# EAGLE design stromplatine3 (EAGLE 6.6.0)

## Sheet 1 of 9
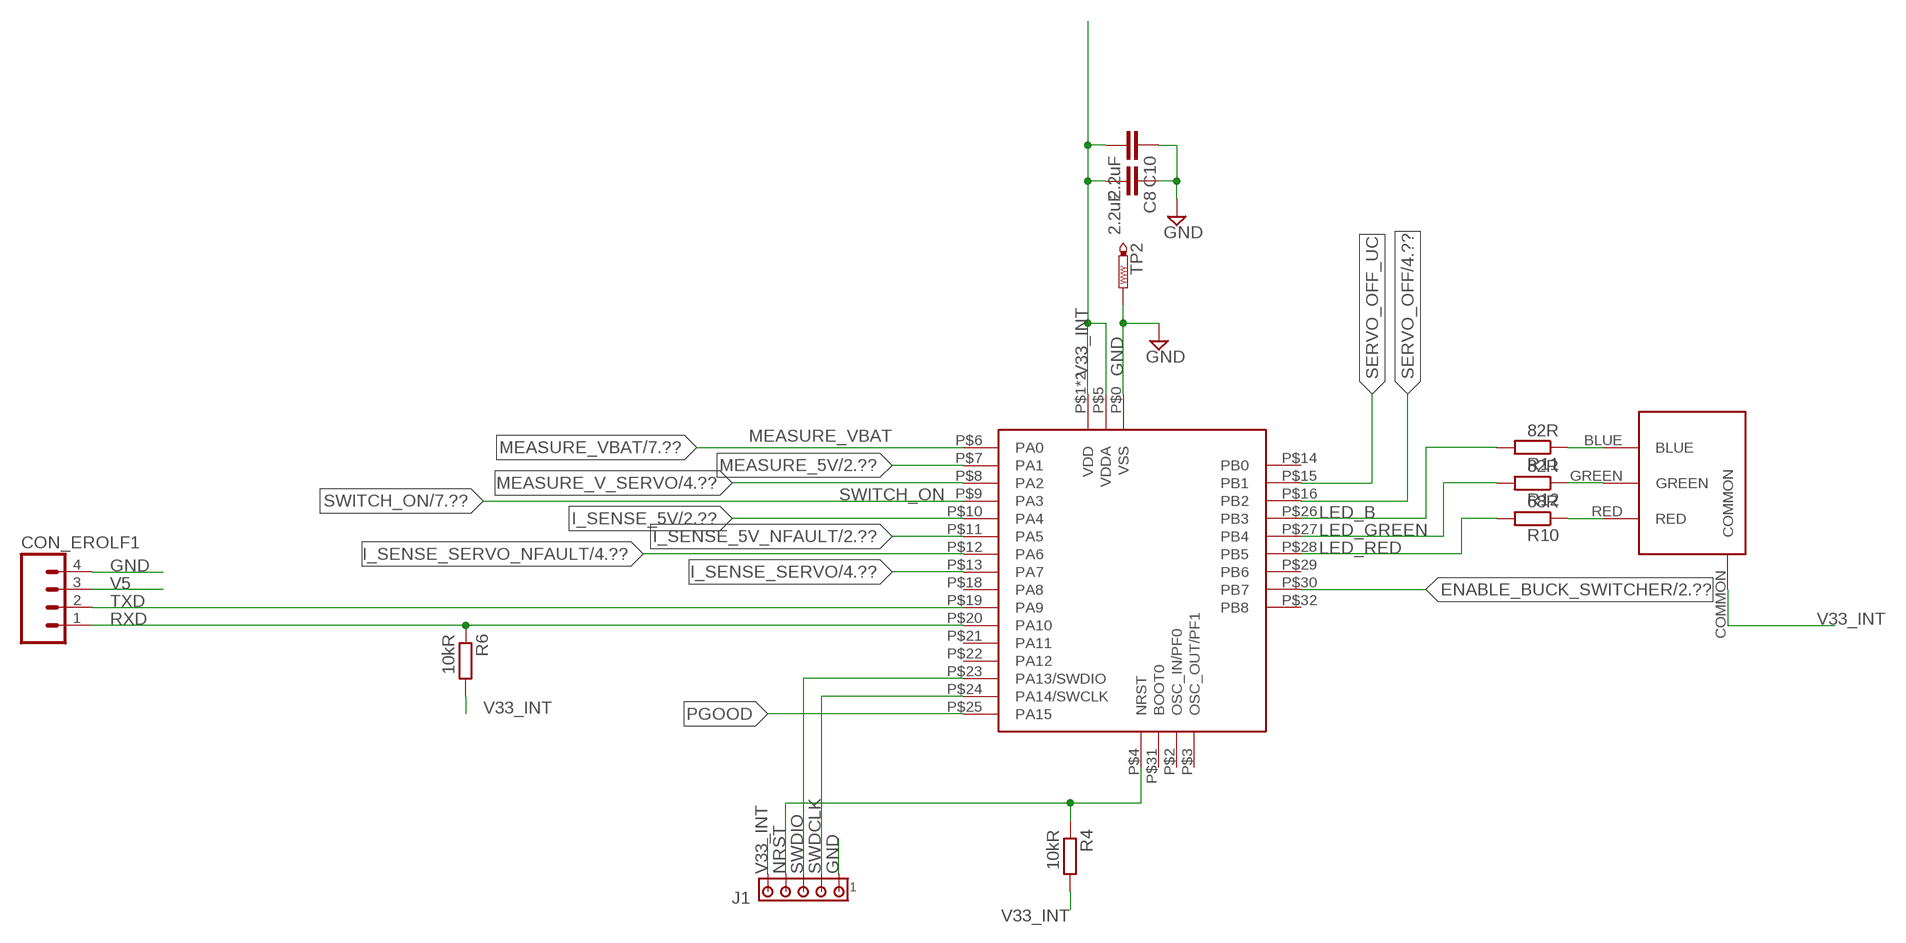
[diagram p0: schematic, sheet 1]

### Parts
C8  2.2uF  C-EUC0402  [C0402]
C10  2.2uF  C-EUC0402  [C0402]
CON_EROLF1  M04  [04P]
J1  MTA05-100  [10X05MTA]
R4  10kR  R-EU_R0603  [R0603]
R6  10kR  R-EU_R0603  [R0603]
R10  68R  R-EU_R0603  [R0603]
R11  82R  R-EU_R0603  [R0603]
R12  82R  R-EU_R0603  [R0603]
TP2  PTR1B1,27  [B1,27]
U$1  STM32F051K8  [UFQFPN32]
U$3  RGB-LED  [4-PLCC]

### Nets
ENABLE_BUCK_SWITCHER: U$1.P$30(PB7) ; also sheet 2
GND: C8.1 C10.1 CON_EROLF1.4 J1.1 TP2.TP U$1.P$0(VSS) ; also sheet 2,3,4,5,6,7,8
I_SENSE_5V: U$1.P$10(PA4) ; also sheet 2
I_SENSE_5V_NFAULT: U$1.P$11(PA5) ; also sheet 2
I_SENSE_SERVO: U$1.P$13(PA7) ; also sheet 4
I_SENSE_SERVO_NFAULT: U$1.P$12(PA6) ; also sheet 4
LED_B: R11.2 U$1.P$26(PB3)
LED_GREEN: R12.2 U$1.P$27(PB4)
LED_RED: R10.2 U$1.P$28(PB5)
MEASURE_5V: U$1.P$7(PA1) ; also sheet 2
MEASURE_V_SERVO: U$1.P$8(PA2) ; also sheet 4
MEASURE_VBAT: U$1.P$6(PA0) ; also sheet 7
N$11: R10.1 U$3.RED
N$12: R12.1 U$3.GREEN
N$13: R11.1 U$3.BLUE
NRST: J1.4 R4.1 U$1.P$4(NRST)
PGOOD: U$1.P$25(PA15)
RXD: CON_EROLF1.1 R6.1 U$1.P$20(PA10)
SERVO_OFF: U$1.P$16(PB2) ; also sheet 4,5
SERVO_OFF_UC: U$1.P$15(PB1)
SWDCLK: J1.2 U$1.P$24(PA14/SWCLK)
SWDIO: J1.3 U$1.P$23(PA13/SWDIO)
SWITCH_ON: U$1.P$9(PA3) ; also sheet 7
TXD: CON_EROLF1.2 U$1.P$19(PA9)
V5: CON_EROLF1.3 ; also sheet 2,3
V33_INT: C8.2 C10.2 J1.5 R4.2 R6.2 U$1.P$1(VDD) U$1.P$5(VDDA) U$1.P$17(VDD) U$3.COMMON ; also sheet 2,4,8
Unconnected: U$1.P$2(OSC_IN/PF0) U$1.P$3(OSC_OUT/PF1) U$1.P$14(PB0) U$1.P$18(PA8) U$1.P$21(PA11) U$1.P$22(PA12) U$1.P$29(PB6) U$1.P$31(BOOT0) U$1.P$32(PB8)

## Sheet 2 of 9
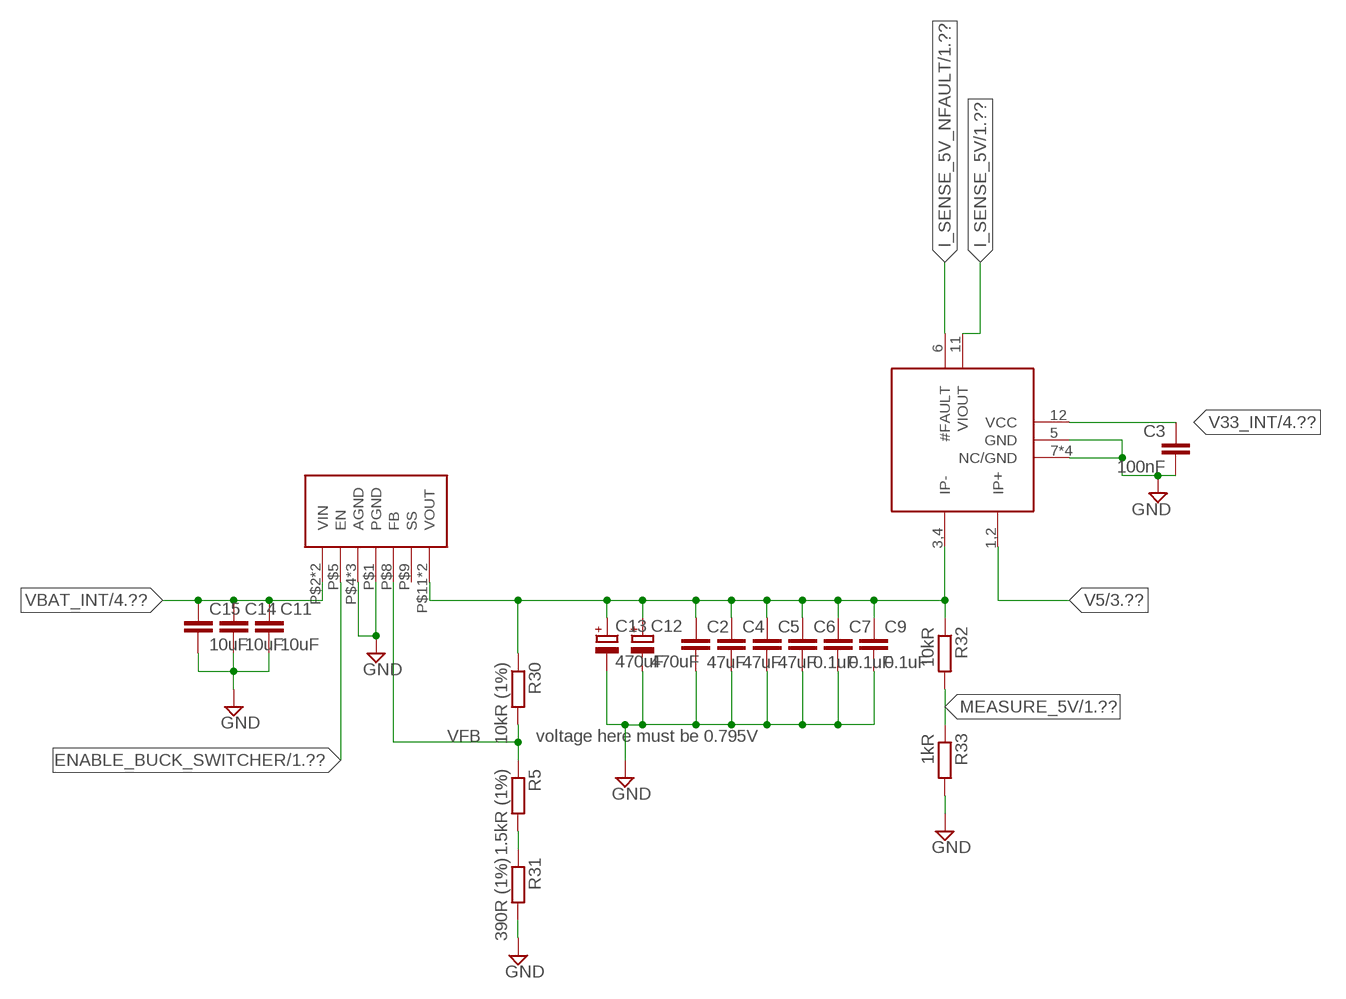
[diagram p1: schematic, sheet 2]

### Parts
C2  47uF  C-EUC1206  [C1206]
C3  100nF  C-EUC0402  [C0402]
C4  47uF  C-EUC1206  [C1206]
C5  47uF  C-EUC1206  [C1206]
C6  0.1uF  C-EUC0603  [C0603]
C7  0.1uF  C-EUC0603  [C0603]
C9  0.1uF  C-EUC0603  [C0603]
C11  10uF  C-EUC1206  [C1206]
C12  470uF  CPOL-EU175TMP-0810  [175TMP-0810]
C13  470uF  CPOL-EU175TMP-0810  [175TMP-0810]
C14  10uF  C-EUC1206  [C1206]
C15  10uF  C-EUC1206  [C1206]
R5  1.5kR (1%)  R-EU_R0603  [R0603]
R30  10kR (1%)  R-EU_R0603  [R0603]
R31  390R (1%)  R-EU_R0603  [R0603]
R32  10kR  R-EU_R0603  [R0603]
R33  1kR  R-EU_R0603  [R0603]
U$10  ACS711  [QFN-12-EX]
U$11  LMZ12010  [TZA11A]

### Nets
ENABLE_BUCK_SWITCHER: U$11.P$5(EN) ; also sheet 1
GND: C2.2 C3.2 C4.2 C5.2 C6.2 C7.2 C9.2 C11.2 C12.- C13.- C14.2 C15.2 R31.2 R33.2 U$10.5(GND) U$10.7(NC/GND) U$10.8(NC/GND) U$10.9(NC/GND) U$10.10(NC/GND) U$11.P$1(PGND) U$11.P$4(AGND) U$11.P$6(AGND) U$11.P$7(AGND) ; also sheet 1,3,4,5,6,7,8
I_SENSE_5V: U$10.11(VIOUT) ; also sheet 1
I_SENSE_5V_NFAULT: U$10.6(#FAULT) ; also sheet 1
MEASURE_5V: R32.2 R33.1 ; also sheet 1
N$4: R5.2 R31.1
N$27: C2.1 C4.1 C5.1 C6.1 C7.1 C9.1 C12.+ C13.+ R30.1 R32.1 U$10.3,4(IP-) U$11.P$11(VOUT) U$11.P$12(VOUT)
V5: U$10.1,2(IP+) ; also sheet 1,3
V33_INT: C3.1 U$10.12(VCC) ; also sheet 1,4,8
VBAT_INT: C11.1 C14.1 C15.1 U$11.P$2(VIN) U$11.P$3(VIN) ; also sheet 4,7,8
VFB: R5.1 R30.2 U$11.P$8(FB)
Unconnected: U$11.P$9(SS)

### Notes on the sheet
- voltage here must be 0.795V

## Sheet 3 of 9
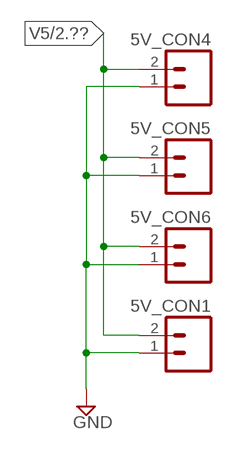
[diagram p2: schematic, sheet 3]

### Parts
5V_CON1  M02  [02P]
5V_CON4  M02  [02P]
5V_CON5  M02  [02P]
5V_CON6  M02  [02P]

### Nets
GND: 5V_CON1.1 5V_CON4.1 5V_CON5.1 5V_CON6.1 ; also sheet 1,2,4,5,6,7,8
V5: 5V_CON1.2 5V_CON4.2 5V_CON5.2 5V_CON6.2 ; also sheet 1,2

## Sheet 4 of 9
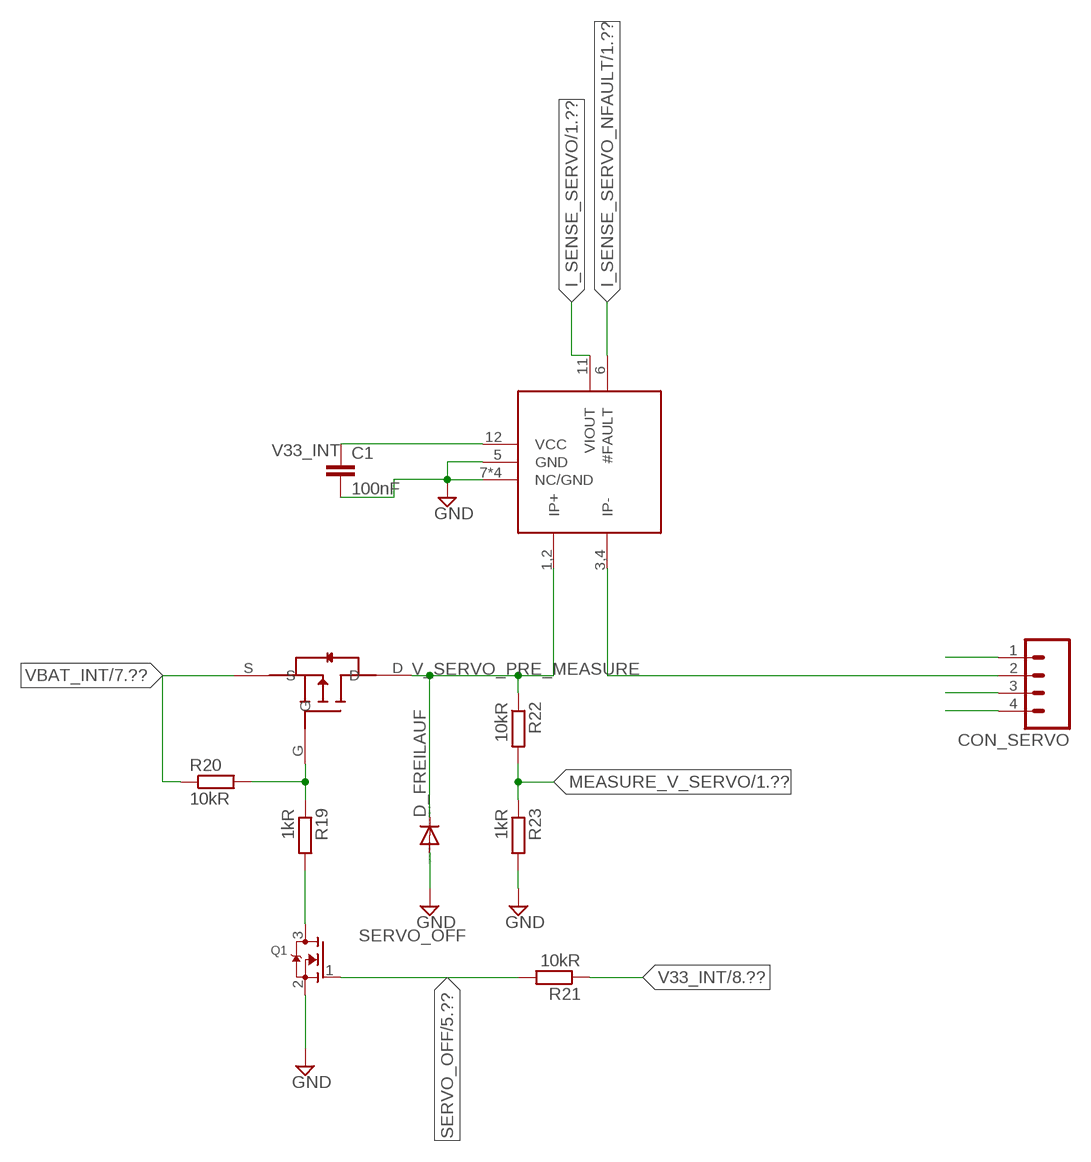
[diagram p3: schematic, sheet 4]

### Parts
C1  100nF  C-EUC0402  [C0402]
CON_SERVO  M04  [04P]
D_FREILAUF  DIODE-DO-214AC  [DO-214AC]
Q1  MOSFET-NREFLOW  [SOT23]
R19  1kR  R-EU_R0603  [R0603]
R20  10kR  R-EU_R0603  [R0603]
R21  10kR  R-EU_R0603  [R0603]
R22  10kR  R-EU_R0603  [R0603]
R23  1kR  R-EU_R0603  [R0603]
U$6  ACS711  [QFN-12-EX]
U$7  MOSFET/AOD417  [TO-252]

### Nets
GND: C1.2 CON_SERVO.1 D_FREILAUF.A Q1.2(S) R23.2 U$6.5(GND) U$6.7(NC/GND) U$6.8(NC/GND) U$6.9(NC/GND) U$6.10(NC/GND) ; also sheet 1,2,3,5,6,7,8
I_SENSE_SERVO: U$6.11(VIOUT) ; also sheet 1
I_SENSE_SERVO_NFAULT: U$6.6(#FAULT) ; also sheet 1
MEASURE_V_SERVO: R22.2 R23.1 ; also sheet 1
N$8: Q1.3(D) R19.2
N$14: R19.1 R20.2 U$7.G
RS485_SERVO_A: CON_SERVO.3
RS485_SERVO_B: CON_SERVO.4
SERVO_OFF: Q1.1(G) R21.2 ; also sheet 1,5
V33_INT: C1.1 R21.1 U$6.12(VCC) ; also sheet 1,2,8
V_SERVO: CON_SERVO.2 U$6.3,4(IP-)
V_SERVO_PRE_MEASURE: D_FREILAUF.C R22.1 U$6.1,2(IP+) U$7.D
VBAT_INT: R20.1 U$7.S ; also sheet 2,7,8

## Sheet 5 of 9
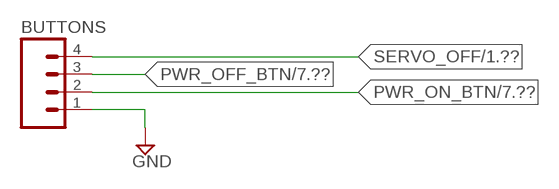
[diagram p4: schematic, sheet 5]

### Parts
BUTTONS  M04  [04P]

### Nets
GND: BUTTONS.1 ; also sheet 1,2,3,4,6,7,8
PWR_OFF_BTN: BUTTONS.3 ; also sheet 7
PWR_ON_BTN: BUTTONS.2 ; also sheet 7
SERVO_OFF: BUTTONS.4 ; also sheet 1,4

## Sheet 6 of 9
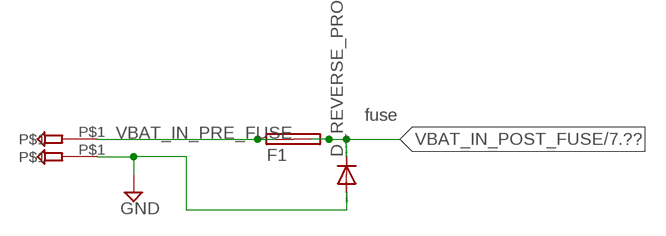
[diagram p5: schematic, sheet 6]

### Parts
D_REVERSE_PROT  DIODE-DO-214AC  [DO-214AC]
F1  SHK20Q  [SHK20Q]
U$8  TP  [TP]
U$9  TP  [TP]

### Nets
GND: D_REVERSE_PROT.A U$9.P$1 ; also sheet 1,2,3,4,5,7,8
VBAT_IN_POST_FUSE: D_REVERSE_PROT.C F1.2A F1.2B ; also sheet 7
VBAT_IN_PRE_FUSE: F1.1A F1.1B U$8.P$1

### Notes on the sheet
- fuse

## Sheet 7 of 9
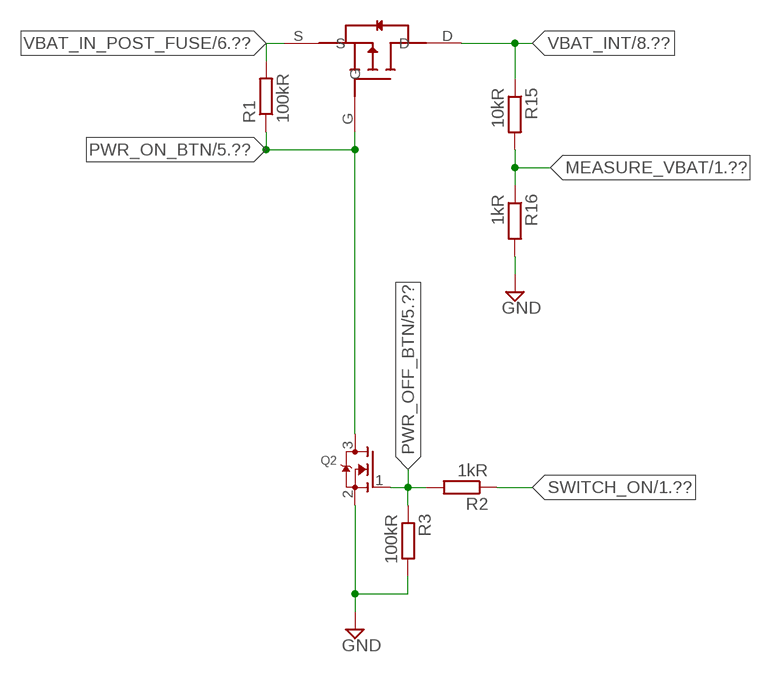
[diagram p6: schematic, sheet 7]

### Parts
Q2  MOSFET-NREFLOW  [SOT23]
R1  100kR  R-EU_R0603  [R0603]
R2  1kR  R-EU_R0603  [R0603]
R3  100kR  R-EU_R0603  [R0603]
R15  10kR  R-EU_R0603  [R0603]
R16  1kR  R-EU_R0603  [R0603]
U$4  MOSFET/AOD417  [TO-252]

### Nets
GND: Q2.2(S) R3.2 R16.2 ; also sheet 1,2,3,4,5,6,8
MEASURE_VBAT: R15.2 R16.1 ; also sheet 1
PWR_OFF_BTN: Q2.1(G) R2.2 R3.1 ; also sheet 5
PWR_ON_BTN: Q2.3(D) R1.1 U$4.G ; also sheet 5
SWITCH_ON: R2.1 ; also sheet 1
VBAT_IN_POST_FUSE: R1.2 U$4.S ; also sheet 6
VBAT_INT: R15.1 U$4.D ; also sheet 2,4,8

## Sheet 8 of 9
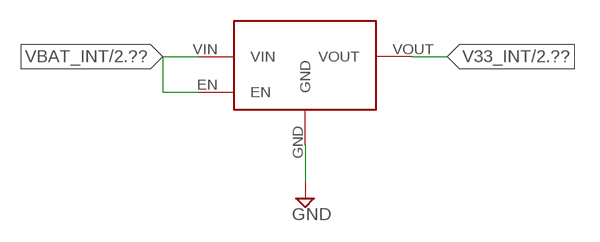
[diagram p7: schematic, sheet 8]

### Parts
U$2  LDO/AP2204  [SOT-23-5]

### Nets
GND: U$2.GND ; also sheet 1,2,3,4,5,6,7
V33_INT: U$2.VOUT ; also sheet 1,2,4
VBAT_INT: U$2.EN U$2.VIN ; also sheet 2,4,7

## Sheet 9 of 9
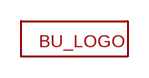
[diagram p8: schematic, sheet 9]

### Parts
U$5  LOGO  [LOGO]

## Library data of the parts
5V_CON1 5V_CON4-5V_CON6 = con-amp-quick:M02: AMP QUICK CONNECTOR; OC_FARNELL: unknown; OC_NEWARK: unknown
BUTTONS CON_EROLF1 CON_SERVO = con-amp-quick:M04: AMP QUICK CONNECTOR; OC_FARNELL: unknown; OC_NEWARK: unknown
C1-C10 = resistor:C-EU: CAPACITOR, European symbol
C11 C14 C15 = resistor:C-EU: CAPACITOR, European symbol; DIGIKEY: 587-1353-1-ND
C12 C13 = resistor:CPOL-EU: POLARIZED CAPACITOR, European symbol; DIGIKEY: 493-3771-1-ND
D_FREILAUF D_REVERSE_PROT = diode:DIODE-: DIODE
F1 = fuse:SHK20Q: FUSE HOLDER 5 x 20 mm, SH contact, E1207 Buerklin 64G6061; OC_FARNELL: unknown; OC_NEWARK: unknown
J1 = con-amp:MTA05-100: AMP connector
Q1 Q2 = adafruit:MOSFET-N: N-Channel Mosfet 2N7002E - 60V 260mA SOT23 [Digikey: 2N7002ET1GOSTR-ND] - REEL BSH103 - 30V 850mA SOT23 [Digikey: 568-5013-1-ND]
R1-R6 R10-R12 R15 R16 R19-R23 R30-R33 = resistor:R-EU_: RESISTOR, European symbol
TP2 = testpad:PTR1: TEST PIN
U$1 = stm32f051:STM32F051K8
U$2 = stromplatine:LDO/AP2204
U$3 = smd-rgbled:RGB-LED: rgb led http://www.digikey.com/product-detail/en/CLVBA-FKA-CAEDH8BBB7A363/CLVBA-FKA-CAEDH8BBB7A363CT-ND/2650500
U$4 U$7 = stromplatine:MOSFET/AOD417
U$5 = berlinunited:LOGO
U$6 U$10 = stromplatine:ACS711
U$8 U$9 = stromplatine:TP
U$11 = stromplatine:LMZ12010

## Board
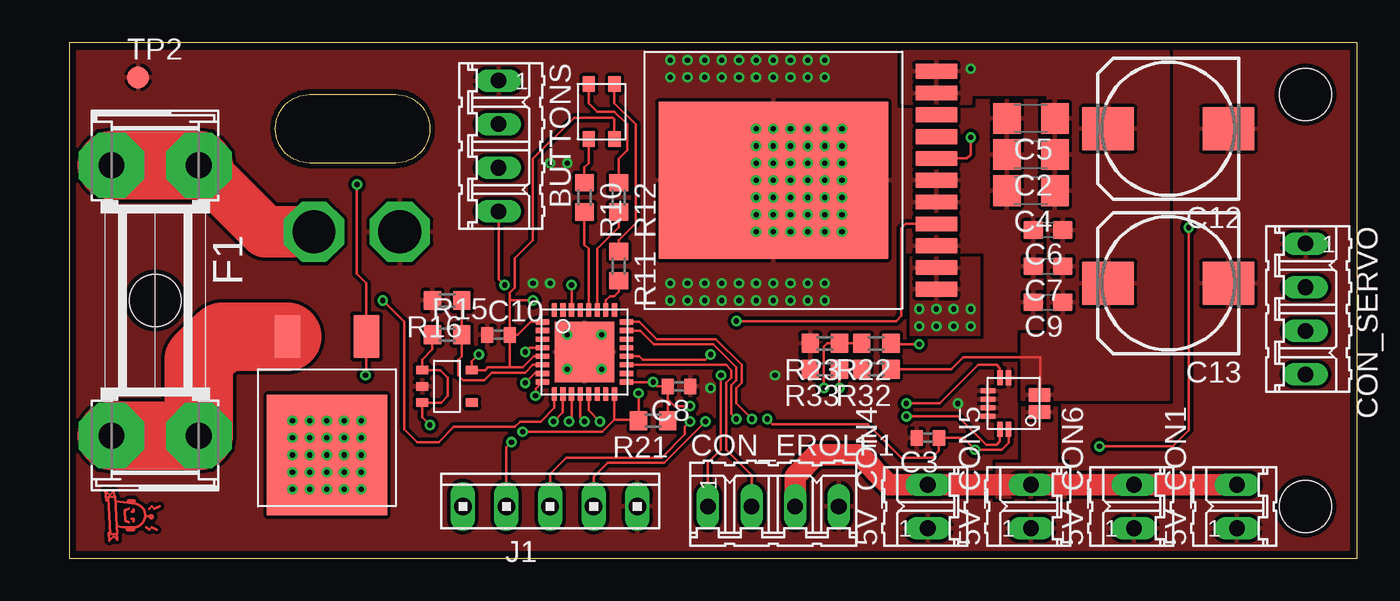
[diagram p9: board, top side]
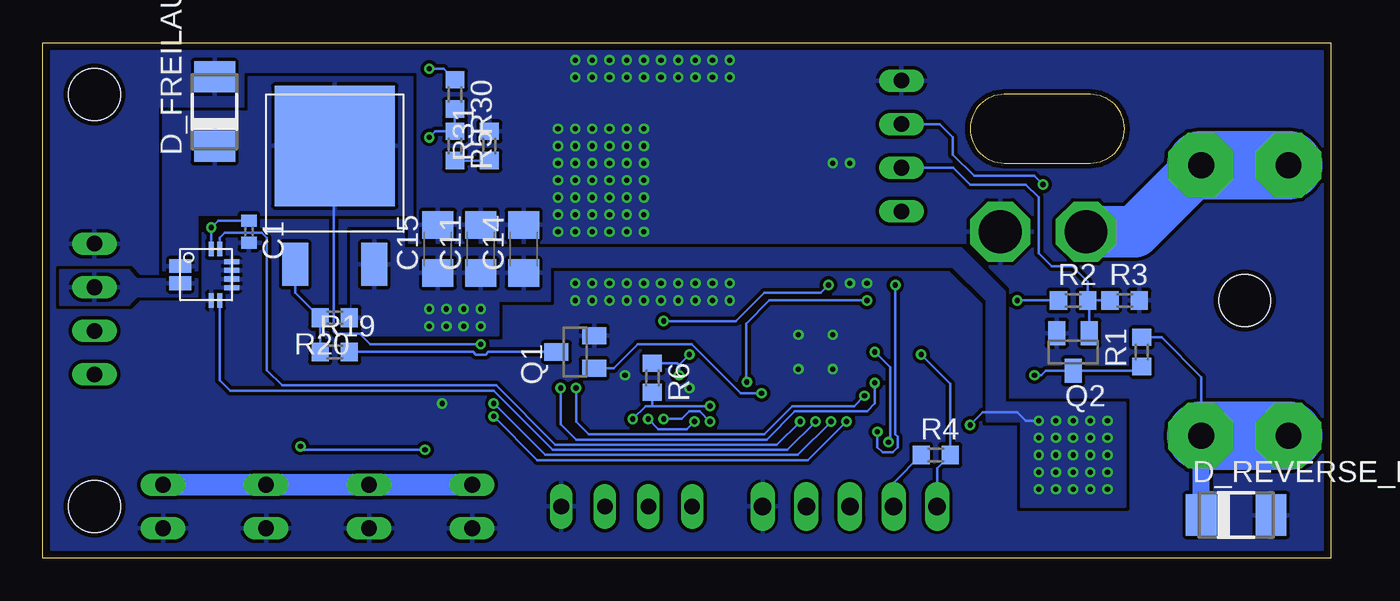
[diagram p10: board, bottom side, seen from below]

Size 75 x 30 mm. Coordinates in mm from the lower left corner, seen from the top.
Outline: 0,0 75,0 75,30 0,30 0,0
Copper layers (1*16): Top 0.035mm / dielectric 1.5mm / Bottom 0.035mm
Design rules "PCB-POOL Standard": minimum track width 0.15mm, minimum drill 0.3mm, track to track 0.15mm, track to pad 0.15mm, pad to pad 0.15mm, via to via 0.15mm, smd to smd 0.15mm, copper to edge 0.3mm, drill to drill 0.2mm, minimum pad ring 0.2mm, minimum via ring 0.15mm, stop-mask expansion 0.075mm, vias tented up to drill 0mil, thermal gap 0.2mm
Holes 3 mm at 5,15 72,3 72,27

### Footprints (pad centres in the part's own frame; a part is rotated, then mirrored left to right if it is on the bottom)
02P = drill 0.914 long: 1 -1.27,0; 2 1.27,0
04P = drill 0.914 long: 1 -3.81,0; 2 -1.27,0; 3 1.27,0; 4 3.81,0
C0402 = smd 0.7 x 0.9: 1 -0.65,0; 2 0.65,0
C1206 = smd 1.6 x 1.8: 1 -1.4,0; 2 1.4,0
C0603 = smd 1.1 x 1: 1 -0.85,0; 2 0.85,0
175TMP-0810 = smd 3 x 2.5: + 3.5,0; - -3.5,0
DO-214AC = smd 1.8 x 2.4: A 2.025,0; C -2.025,0
SHK20Q = drill 1.5 pad 3.81 octagon: 1A -7.874,2.54; 1B -7.874,-2.54; 2A 7.874,2.54; 2B 7.874,-2.54
10X05MTA = drill 1.016 long: 1 5.08,0; 2 2.54,0; 3 0,0; 4 -2.54,0; 5 -5.08,0
SOT23 = smd 1 x 1.4: 1 -0.95,-1.1; 2 0.95,-1.1; 3 0,1.1
R0603 = smd 1 x 1.1: 1 -0.85,0; 2 0.85,0
B1,27 = smd 1.27 x 1.27: TP 0,0
UFQFPN32 = smd 3.45 x 3.54: P$0 0,0 | smd 0.8 x 0.3: P$1 -2.45,1.75; P$2 -2.45,1.25; P$3 -2.45,0.75; P$4 -2.45,0.25; P$5 -2.45,-0.25; P$6 -2.45,-0.75; P$7 -2.45,-1.25; P$8 -2.45,-1.75; P$17 2.45,-1.75; P$18 2.45,-1.25; P$19 2.45,-0.75; P$20 2.45,-0.25; P$21 2.45,0.25; P$22 2.45,0.75; P$23 2.45,1.25; P$24 2.45,1.75 | smd 0.3 x 0.8: P$9 -1.75,-2.45; P$10 -1.25,-2.45; P$11 -0.75,-2.45; P$12 -0.25,-2.45; P$13 0.25,-2.45; P$14 0.75,-2.45; P$15 1.25,-2.45; P$16 1.75,-2.45; P$25 1.75,2.45; P$26 1.25,2.45; P$27 0.75,2.45; P$28 0.25,2.45; P$29 -0.25,2.45; P$30 -0.75,2.45; P$31 -1.25,2.45; P$32 -1.75,2.45
SOT-23-5 = smd 0.5 x 0.7: ADJ/NC 0.95,1.45; EN 0.95,-1.45; GND 0,-1.45; VIN -0.95,-1.45; VOUT -0.95,1.45
4-PLCC = smd 0.9 x 0.7: BLUE 1.6,-0.75; COMMON -1.6,-0.75; GREEN 1.6,0.75; RED -1.6,0.75
TO-252 = smd 7 x 7: D 0,0 | smd 1.5 x 2.5: G -2.3,-6.9; S 2.3,-6.9
QFN-12-EX = smd 1.27 x 0.8: 1,2 -1.5,0.5; 3,4 -1.5,-0.5 | smd 0.3 x 0.85: 5 0.3,-1.5; 6 0.8,-1.5; 11 0.8,1.5; 12 0.3,1.5 | smd 0.85 x 0.3: 7 1.5,-0.75; 8 1.5,-0.25; 9 1.5,0.25; 10 1.5,0.75
TP = drill 2.5 pad 3.5 octagon: P$1 0,0
TZA11A = smd 9.125 x 13.37: P$1 0,0 | smd 0.86 x 2.41: P$2 -6.35,-9.5; P$3 -5.08,-9.5; P$4 -3.81,-9.5; P$5 -2.54,-9.5; P$6 -1.27,-9.5; P$7 0,-9.5; P$8 1.27,-9.5; P$9 2.54,-9.5; P$10 3.81,-9.5; P$11 5.08,-9.5; P$12 6.35,-9.5

### Placement (x,y rotation side)
5V_CON1  68,3 90 top
5V_CON4  50,3 90 top
5V_CON5  56,3 90 top
5V_CON6  62,3 90 top
BUTTONS  25,24 270 top
C1  63,19 270 bottom
C2  56,23.5 180 top
C3  50,7 180 top
C4  56,21.4 180 top
C5  56,25.6 180 top
C6  57,19.1 180 top
C7  57,17 180 top
C8  35.5,10 180 top
C9  57,14.9 180 top
C10  25,13 0 top
C11  49.5,18 90 bottom
C12  64,25 180 top
C13  64,16 180 top
C14  47,18 90 bottom
C15  52,18 90 bottom
CON_EROLF1  41,3 0 top
CON_SERVO  72,14.5 270 top
D_FREILAUF  65,26 90 bottom
D_REVERSE_PROT  5.5,2.5 0 bottom
F1  5,15 270 top
J1  28,3 0 top
Q1  44,12 90 bottom
Q2  15,12 180 bottom
R1  11,12 90 bottom
R2  15,15 0 bottom
R3  12,15 0 bottom
R4  23,6 0 bottom
R5  51,24 270 bottom
R6  39.5,10.5 270 bottom
R10  30,21 270 top
R11  32,17 270 top
R12  32,21 270 top
R15  22,13 0 top
R16  22,15 180 top
R19  58,12 0 bottom
R20  58,14 180 bottom
R21  34,8 180 top
R22  47,12.5 180 top
R23  44,12.5 180 top
R30  51,27 270 bottom
R31  49,24 90 bottom
R32  47,11 180 top
R33  44,11 180 top
TP2  4,28 0 top
U$1  30,12 0 top
U$2  22,10 270 top
U$3  31,26 90 top
U$4  15,6 180 top
U$5  3.5,2.5 270 top
U$6  65.5,16.5 0 bottom
U$7  58,24 0 bottom
U$8  14.25,19 0 top
U$9  19.25,19 0 top
U$10  55,9 180 top
U$11  41,22 90 top

### Tracks (layer width: path | path; a pad name or v marks a point on that pad's centre or on a via)
ENABLE_BUCK_SWITCHER  (via drill 0.3)
  Top 0.15: U$11.P$5 48.71,19.46 48.45,19.2 48.45,14.1 48.15,13.8 v38.85,13.8 | U$1.P$30 v29.25,15.9
  Bottom 0.15: v29.25,15.9 29.7,15.45 33,15.45 34.65,13.8 v38.85,13.8
GND  (via drill 0.3)
  Top 0.15: v29,11 U$1.P$0
  other vias: 45,19 45,20 45,21 45,22 45,23 45,24 45,25 44,19 43,19 42,19 41,19 40,19 44,20 43,20 42,20 41,20 40,20 44,21 43,21 42,21 41,21 40,21 44,22 43,22 42,22 41,22 40,22 44,23 43,23 42,23 41,23 40,23 44,24 43,24 42,24 41,24 40,24 44,25 43,25 42,25 41,25 40,25 28,23 29,13 31,13 31,11 37,16 38,16 39,16 40,16 41,16 42,16 43,16 44,16 44,15 43,15 42,15 41,15 40,15 39,15 38,15 37,15 36,15 36,16 35,16 35,15 44,28 43,28 42,28 41,28 40,28 39,28 38,28 37,28 36,28 35,28 35,29 36,29 37,29 38,29 39,29 40,29 41,29 42,29 43,29 44,29 51.75,9 27,16 28,16 29,23 41.1,10.65 37.35,9.9
  pour Bottom (isolate 0.2, rank 2): 0.5,29.5 74.5,29.5 74.5,0.5 0.5,0.5
  pour Top (isolate 0.203, rank 2): 0.5,29.5 74.5,29.5 74.5,0.5 0.5,0.5
I_SENSE_5V  (via drill 0.3)
  Top 0.15: U$1.P$10 28.75,8.5 v28.2,7.95 | U$10.11 54.2,6.8 54,6.6 53.4,6.6 51.75,8.25 v48.75,8.25
  Bottom 0.15: v28.2,7.95 30.45,5.7 46.2,5.7 v48.75,8.25
I_SENSE_5V_NFAULT  (via drill 0.3)
  Top 0.15: U$1.P$11 29.25,8.1 v29.1,7.95 | v48.75,9 50.7,9 52.95,11.25 54,11.25 54.2,11.05 U$10.6
  Bottom 0.15: v29.1,7.95 31.05,6 45.75,6 v48.75,9
I_SENSE_SERVO  (via drill 0.3)
  Top 0.15: U$1.P$13 30.25,8.6 v30.9,7.95
  Bottom 0.15: v30.9,7.95 32.25,6.6 45.15,6.6 48.6,10.05 61.05,10.05 61.95,10.95 61.95,18.65 62.25,18.95 64.4,18.95 64.7,18.65 U$6.11
I_SENSE_SERVO_NFAULT  (via drill 0.3)
  Top 0.15: U$1.P$12 29.75,8.2 v30,7.95
  Bottom 0.15: v30,7.95 31.65,6.3 45.3,6.3 48.75,9.75 64.1,9.75 64.7,10.35 U$6.6
LED_B
  Top 0.15: U$1.P$26 31.25,15 31.5,15.25 31.75,15.25 32,15.5 R11.2
LED_GREEN
  Top 0.15: U$1.P$27 30.75,18 32,19.25 R12.2
LED_RED
  Top 0.15: U$1.P$28 30.25,18 30,18.25 R10.2
MEASURE_5V  (via drill 0.3)
  Top 0.15: R32.2 R33.1 v44.85,9.9 | U$1.P$7 27.1,10.75 v26.55,10.2
  Bottom 0.15: v26.55,10.2 26.55,9 27,8.55 31.2,8.55 32.85,6.9 43.95,6.9 44.85,7.8 v44.85,9.9
MEASURE_V_SERVO  (via drill 0.3)
  Top 0.15: U$1.P$8 27.15,9.85 v27.15,9.45 | R22.2 R23.1 44.15,12.5 43.95,12.3 v43.95,9.9
  Bottom 0.15: v27.15,9.45 27.75,8.85 31.35,8.85 33,7.2 43.2,7.2 43.95,7.95 v43.95,9.9
MEASURE_VBAT
  Top 0.15: U$1.P$6 26.99,11.25 26.54,10.8 24.61,10.8 24.16,10.35 22.95,10.35 22.65,10.65 22.65,11.55 22.85,11.75 R15.2 R16.1
N$4
  Bottom 0.15: R31.1 R5.2
N$8
  Bottom 0.15: Q1.3 49.05,12 49.2,11.85 49.8,11.85 49.95,12 R19.2
N$11
  Top 0.15: R10.1 30,22.75 30.25,23 U$3.RED
N$12
  Top 0.15: R12.1 32,23.25 32.5,23.75 32.5,25.25 31.75,26 30.75,26 30.25,26.5 U$3.GREEN
N$13
  Top 0.15: R11.1 32,18.5 33,19.5 33,25.25 31.75,26.5 U$3.BLUE
N$14
  Bottom 0.15: U$7.G 60.3,15.45 R20.2 R19.1
N$27  (via drill 0.3)
  Top 0.15: R32.1 51.35,11 52.05,11.7 56.55,11.7 56.55,9.55 U$10.3,4
  Bottom 0.15: R30.1 51.65,28.5 v52.5,28.5
  pour Top: 48.5,29.5 48.5,26.5 52.5,26.5 52.5,27 57,27 57,13 55.5,13 55.5,9.25 64,9.25 64,29.5
NRST  (via drill 0.3)
  Top 0.15: U$1.P$4 26.8,12.25 v26.55,12 | v25.75,6.75 25.46,6.46 J1.4
  Bottom 0.15: v26.55,12 25.65,11.1 25.65,6.85 v25.75,6.75 | R4.1 25.46,4.39 J1.4
PWR_OFF_BTN
  Bottom 0.15: R2.2 R3.1 | R2.2 14.05,14.9 Q2.1 | R2.2 14.15,16.1 15.05,17 16.25,17 17,17.75 17,21 17.75,21.75 21,21.75 21.98,22.73 BUTTONS.3
PWR_ON_BTN  (via drill 0.3)
  Top 0.15: 17.25,12.95 U$4.G | U$4.G 17.3,16 16.75,16.55 v16.75,21.75 | v17.25,10.65 17.3,10.7 U$4.G
  Bottom 0.15: R1.1 11.25,10.9 Q2.3 16.6,10.9 16.85,10.65 v17.25,10.65 | v16.75,21.75 17.25,22.25 20.75,22.25 22,23.5 22,24.5 22.77,25.27 BUTTONS.2
RXD  (via drill 0.3)
  Top 0.15: U$1.P$20 33.2,11.75 33.4,11.55 37.05,11.55 v37.35,11.85 | v37.95,10.65 37.95,6.3 37.19,5.54 CON_EROLF1.1
  Bottom 0.15: v37.35,11.85 37.95,11.25 | 37.95,11.25 v37.95,10.65 | R6.1 38.05,11.35 37.95,11.25
SERVO_OFF  (via drill 0.3)
  Top 0.15: 25.05,20.14 BUTTONS.4 25,16.25 v25.35,15.9 | v26.4,7.35 31.05,7.35 31.75,8.05 | 31.75,8.05 U$1.P$16 | 31.75,8.05 33.1,8.05 R21.2 v33.15,9.6
  Bottom 0.15: v25.35,15.9 25.35,7.2 25.2,7.05 25.2,6.45 25.5,6.15 26.1,6.15 26.4,6.45 v26.4,7.35 | Q1.1 41.75,11.05 40.35,12.45 37.2,12.45 34.35,9.6 v33.15,9.6
SWDCLK  (via drill 0.3)
  Top 0.15: U$1.P$24 33.2,13.75 34.2,12.75 37.65,12.75 39.15,11.25 39.15,10.2 38.85,9.9 38.85,9 v39.75,8.1 | v37.05,7.95 34.65,5.55 31.35,5.55 30.54,4.74 J1.2
  Bottom 0.15: v37.05,7.95 37.5,7.5 39.15,7.5 v39.75,8.1
SWDIO  (via drill 0.3)
  Top 0.15: U$1.P$23 33.25,13.25 34.05,12.45 37.5,12.45 38.85,11.1 38.85,10.35 38.55,10.05 38.55,8.4 v38.85,8.1 | v36.15,7.95 35.85,7.65 35.85,7.2 34.5,5.85 28.95,5.85 28,4.9 J1.3
  Bottom 0.15: v36.15,7.95 36.75,8.55 37.35,8.55 37.8,8.1 v38.85,8.1
SWITCH_ON  (via drill 0.3)
  Top 0.15: v18.25,15 19.5,13.75 19.5,7.5 20.25,6.75 21.5,6.75 22.4,7.65 25.95,7.65 26.25,7.95 27.45,7.95 28.25,8.75 U$1.P$9
  Bottom 0.15: R2.1 v18.25,15
TXD
  Top 0.15: U$1.P$19 38.25,11.25 38.55,10.95 38.55,10.5 38.25,10.2 38.25,6.3 39.73,4.82 CON_EROLF1.2
V5
  Top 1.25: 5V_CON1.2 5V_CON6.2 5V_CON5.2 5V_CON4.2 47.73,4.27 46,6 43.5,6 42.27,4.77 CON_EROLF1.3
  Bottom 1.25: 5V_CON4.2 5V_CON5.2 5V_CON6.2 5V_CON1.2
  pour Top (isolate 0.2): 55.5,8.75 57.5,8.75 57.5,5.5 58,5.5 58,3.5 54,3.5 54,5.5 55.5,5.5
V33_INT  (via drill 0.3)
  Top 0.15: U$1.P$5 27.05,11.75 26.4,11.1 25.65,11.1 | U$1.P$17 v34,10.25 34.25,10 C8.2 34.85,9.25 | U$3.COMMON 31.75,25.55 31.65,25.65 29.4,25.65 27,23.25 27,18.5 25.95,17.45 25.95,15.75 25.65,15.45 25.65,15 | 25.65,15 C10.2 | U$1.P$1 26.87,13.75 26.12,13 C10.2 | 25.6,12.95 C10.2 | 25.65,11.1 24.38,11.1 24.23,10.95 U$2.VOUT 23.45,11.45 v23.85,11.85 | 25.65,11.1 C10.2 | 34.85,9.25 R21.1 | v27,15 25.65,15 | U$10.12 54.7,6.7 54.3,6.3 v52.75,6.3 52.05,7 C3.1 50.65,6.25 50.25,5.85 48.45,5.85 46.5,7.8 40.95,7.8 v40.65,8.1 | v60,6.5 64.25,6.5 65.2,7.45 v65.2,19.25 | 34.85,9.25 35.25,8.85 v36.15,8.85
  Bottom 0.15: v23.85,11.85 22.15,10.15 R4.2 22.92,5.23 J1.5 | v27,15 32.7,15 34.05,13.65 34.05,10.3 v34,10.25 | U$6.12 v65.2,19.25 64.8,19.65 C1.1 | v52.75,6.3 59.8,6.3 v60,6.5 | v36.15,8.85 39.5,8.85 | 39.5,8.85 39.9,8.85 v40.65,8.1 | R6.2 39.5,8.85
V_SERVO
  pour Bottom (isolate 0.2): 66,16.25 69.5,16.25 70,16.75 74,16.75 74,14.75 70,14.75 69.5,15.25 66,15.25
V_SERVO_PRE_MEASURE  (via drill 0.3)
  Top 0.15: R22.1 47.9,12.45 v49.5,12.45
  Bottom 0.15: v49.5,12.45 55.95,12.45 56.55,13.05 57.9,13.05 58.05,13.2 58.05,23.95 U$7.D
  pour Bottom (isolate 0.2): 53.5,28 63,28 63,26 68,26 68,16.75 66,16.75 66,20 53.5,20
VBAT_IN_POST_FUSE
  Top 4: F1.2B F1.2A 7.54,11.54 8.9,12.9 U$4.S
  Bottom 0.15: R1.2 9.85,12.85 7.54,10.54 F1.2A
  Bottom 1: D_REVERSE_PROT.C F1.2A
  Bottom 4: F1.2B F1.2A
VBAT_IN_PRE_FUSE
  Top 3: F1.1A 11.41,19 U$8.P$1
  Top 4: F1.1B F1.1A
  Bottom 3: 11.41,19 F1.1A | U$8.P$1 11.5,19
  Bottom 4: F1.1B F1.1A
VBAT_INT  (via drill 0.3)
  Top 0.15: R15.1 21.15,12.15 20.55,11.55 U$2.VIN 21.6,10.95 22.05,10.5 22.05,9.45 21.65,9.05 U$2.EN 20.55,8.2 v21,7.75
  Bottom 0.15: v21,7.75 20.25,8.5 18.25,8.5 17.75,8 v17,8
  other vias: 13,8 14,8 15,8 16,8 17,7 16,7 15,7 14,7 13,7 13,6 14,6 15,6 16,6 17,6 17,5 17,4 16,4 16,5 15,5 15,4 14,4 14,5 13,5 13,4 49.5,14.5 50.5,14.5 51.5,14.5 52.5,14.5 52.5,13.5 51.5,13.5 50.5,13.5 49.5,13.5
  pour Bottom: 12,9 12,3 18,3 18,8 20,8 20,15 22,17 45.5,17 45.5,15 48.5,15 48.5,13 57,13 57,19 54,19 54,18 21.5,18 19,15.5 19,9
  pour Top: 49,17.5 53,17.5 53,14 53,13 49,13
VFB  (via drill 0.3)
  Top 0.15: v52.5,24.5 52.5,23.5 52.27,23.27 U$11.P$8
  Bottom 0.15: R30.2 R5.1 52.15,24.85 v52.5,24.5